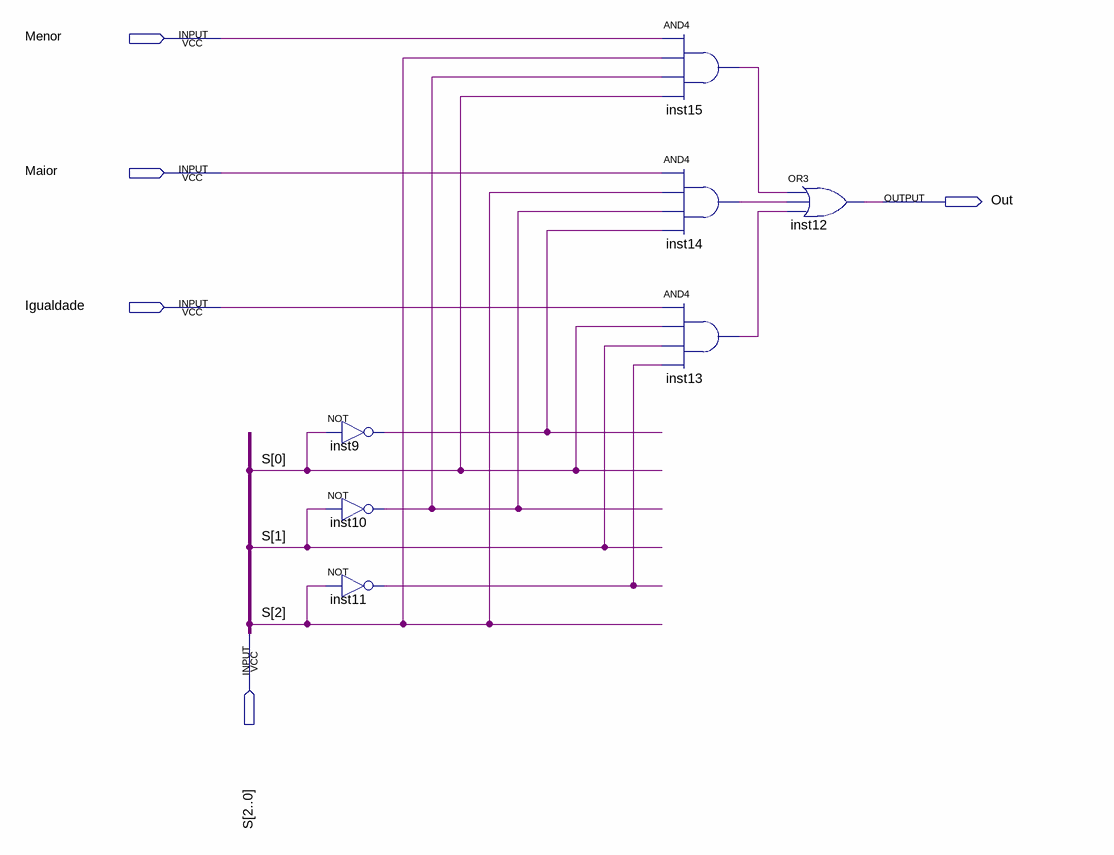
[diagram p0: schematic sheet]
// Quartus schematic MuxBool.bdf as structural Verilog: 7 symbols, 5 pins
module MuxBool (
  input  Menor,
  input  Maior,
  input  Igualdade,
  input  [2:0] S,
  output Out
);

  wire inst9_out, inst10_out, inst11_out, inst13_out, inst14_out, inst15_out;

  not inst9 (inst9_out, S[0]);
  not inst10 (inst10_out, S[1]);
  not inst11 (inst11_out, S[2]);
  and inst15 (inst15_out, Menor, S[2], inst10_out, S[0]);
  and inst14 (inst14_out, Maior, S[2], inst10_out, inst9_out);
  and inst13 (inst13_out, Igualdade, S[0], S[1], inst11_out);
  or inst12 (Out, inst15_out, inst14_out, inst13_out);
endmodule
